# EAGLE design baro (EAGLE 6.2)
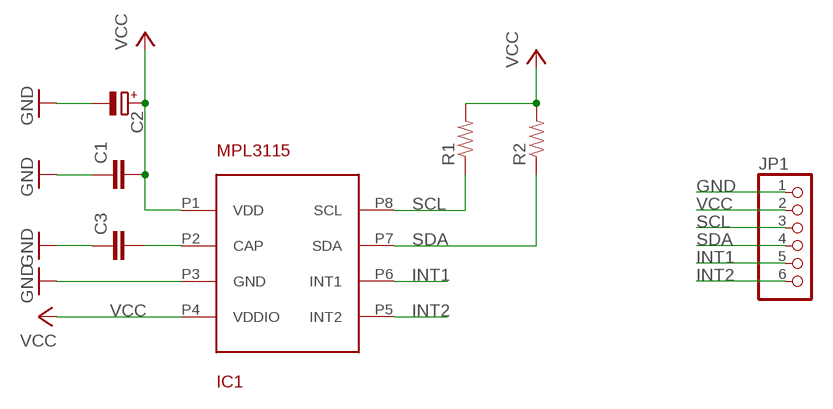
[diagram p0: schematic, sheet 1]

## Parts
C1  CAP0805  [0805]
C2  CPOL-EUSMCC  [SMC_C]
C3  CAP0805  [0805]
IC1  MPL3115A2  [LGA8]
JP1  PINHD-1X6  [1X06]
R1  RESISTOR0805-RES  [0805]
R2  RESISTOR0805-RES  [0805]

## Nets
GND: C1.1 C2.- C3.1 IC1.P3(GND) JP1.1
INT1: IC1.P6(INT1) JP1.5
INT2: IC1.P5(INT2) JP1.6
N$2: C3.2 IC1.P2(CAP)
SCL: IC1.P8(SCL) JP1.3 R1.1
SDA: IC1.P7(SDA) JP1.4 R2.1
VCC: C1.2 C2.+ IC1.P1(VDD) IC1.P4(VDDIO) JP1.2 R1.2 R2.2

## Library data of the parts
C1 C3 = SparkFun-Passives:CAP: Capacitor Standard 0603 ceramic capacitor, and 0.1" leaded capacitor.
C2 = rcl:CPOL-EU: POLARIZED CAPACITOR, European symbol
IC1 = seb:MPL3115A2
JP1 = pinhead:PINHD-1X6: PIN HEADER
R1 R2 = SparkFun-Passives:RESISTOR: Resistor Basic schematic elements and footprints for 0603, 1206, and PTH resistors.

## Board
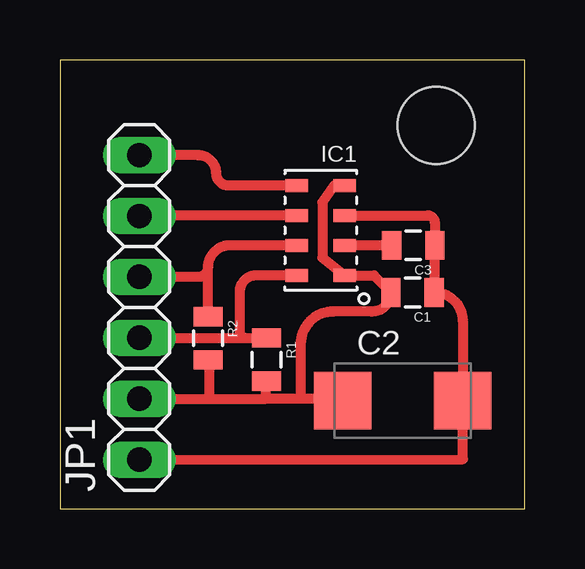
[diagram p1: board, top side]

Size 19.38 x 18.73 mm. Coordinates in mm from the lower left corner, seen from the top.
Outline: 0,0 19.38,0 19.38,18.73 0,18.73 0,0
Copper layers (1*16): Top 0.035mm / dielectric 1.5mm / Bottom 0.035mm
Design rules "default": minimum track width 10mil, minimum drill 24mil, track to track 8mil, track to pad 8mil, pad to pad 8mil, via to via 8mil, smd to smd 8mil, copper to edge 40mil, drill to drill 8mil, minimum pad ring 10mil, minimum via ring 8mil, stop-mask expansion 4mil, vias tented up to drill 0mil, thermal gap 10mil
Holes 3.2 mm at 15.68,16

### Footprints (pad centres in the part's own frame; a part is rotated, then mirrored left to right if it is on the bottom)
0805 = smd 0.8 x 1.2: 1 -0.9,0; 2 0.9,0
SMC_C = smd 2.4 x 2.4: + -2.5,0; - 2.5,0
LGA8 = smd 0.95 x 0.55: P1 -1,1.875; P2 -1,0.625; P3 -1,-0.625; P4 -1,-1.875; P5 1,-1.875; P6 1,-0.625; P7 1,0.625; P8 1,1.875
1X06 = drill 1.016 long: 1 -6.35,0; 2 -3.81,0; 3 -1.27,0; 4 1.27,0; 5 3.81,0; 6 6.35,0

### Placement (x,y rotation side)
C1  14.71,9.03 180 top
C2  14.29,4.53 0 top
C3  14.73,11 180 top
IC1  10.88,11.62 180 top
JP1  3.31,8.41 90 top
R1  8.62,6.23 270 top
R2  6.18,7.12 270 top

### Tracks (layer width: path | path; a pad name or v marks a point on that pad's centre or on a via)
GND
  Top 0.406: 3.47,1.9 JP1.1 16.8,2.08 C2.- 16.79,7.85 arc90 C1.1 15.61,11 C3.1 arc-90 C3.1 15.63,11.95 arc90 15.34,12.24 IC1.P3
INT1
  Top 0.406: IC1.P6 3.33,12.24 JP1.5
INT2
  Top 0.406: IC1.P5 7.02,13.49 arc-90 6.52,14 arc90 5.76,14.76 JP1.6
N$2
  Top 0.406: C3.2 IC1.P2
SCL
  Top 0.406: JP1.3 7.5,7.14 | R1.1 7.72,7.14 7.5,7.14 | IC1.P8 8.18,9.74 arc90 7.5,9.06 7.5,7.14
SDA
  Top 0.406: IC1.P7 7.08,10.99 arc90 6.17,10.09 | 6.17,10.09 arc-90 5.77,9.68 JP1.4 | R2.1 arc-90 R2.1 6.17,10.09
VCC
  Top 0.406: IC1.P4 11.43,13.49 10.94,12.8 10.94,10.48 IC1.P1 13.1,9.74 C1.2 arc-90 13.01,8.24 11.39,8.24 arc90 10.04,6.89 10.04,4.61 | JP1.2 6.22,4.6 | 6.22,4.6 8.6,4.6 | 8.6,4.6 R1.2 | R2.2 6.22,6.16 6.22,4.6 | 10.04,4.61 arc-90 10.03,4.6 8.6,4.6 | 10.04,4.61 11.71,4.61 arc-90 C2.+

### Text on the board
Document: absägen für onboardmodul